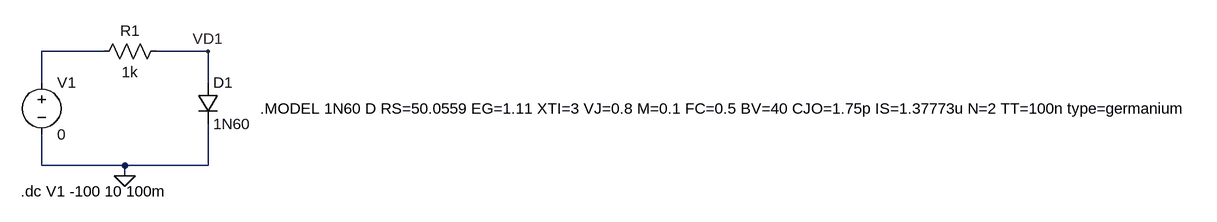
[diagram p0: schematic 1N60.asc]
1N60.asc, the LTspice schematic file:
Version 4.1
SHEET 1 1868 680
WIRE 80 64 -16 64
WIRE 240 64 160 64
WIRE -16 112 -16 64
WIRE 240 112 240 64
WIRE -16 240 -16 192
WIRE 112 240 -16 240
WIRE 240 240 240 176
WIRE 240 240 112 240
WIRE 112 256 112 240
FLAG 112 256 0
FLAG 240 64 VD1
SYMBOL voltage -16 96 R0
WINDOW 123 0 0 Left 0
WINDOW 39 0 0 Left 0
SYMATTR InstName V1
SYMATTR Value 0
SYMBOL diode 224 112 R0
SYMATTR InstName D1
SYMATTR Value 1N60
SYMBOL res 176 48 R90
WINDOW 0 0 56 VBottom 2
WINDOW 3 32 56 VTop 2
SYMATTR InstName R1
SYMATTR Value 1k
TEXT -48 280 Left 2 !.dc V1 -100 10 100m
TEXT 320 152 Left 2 !.MODEL 1N60 D RS=50.0559 EG=1.11 XTI=3 VJ=0.8 M=0.1 FC=0.5 BV=40 CJO=1.75p IS=1.37773u N=2 TT=100n type=germanium

The netlist it stands for:
* 1N60.asc
V1 N001 0 0
D1 VD1 0 1N60
R1 VD1 N001 1k
.model D D
.lib standard.dio
.dc V1 -100 10 100m
.MODEL 1N60 D RS=50.0559 EG=1.11 XTI=3 VJ=0.8 M=0.1 FC=0.5 BV=40 CJO=1.75p IS=1.37773u N=2 TT=100n type=germanium
.backanno
.end